# EAGLE design motors_motherBoard_simple (EAGLE 9.0.1)
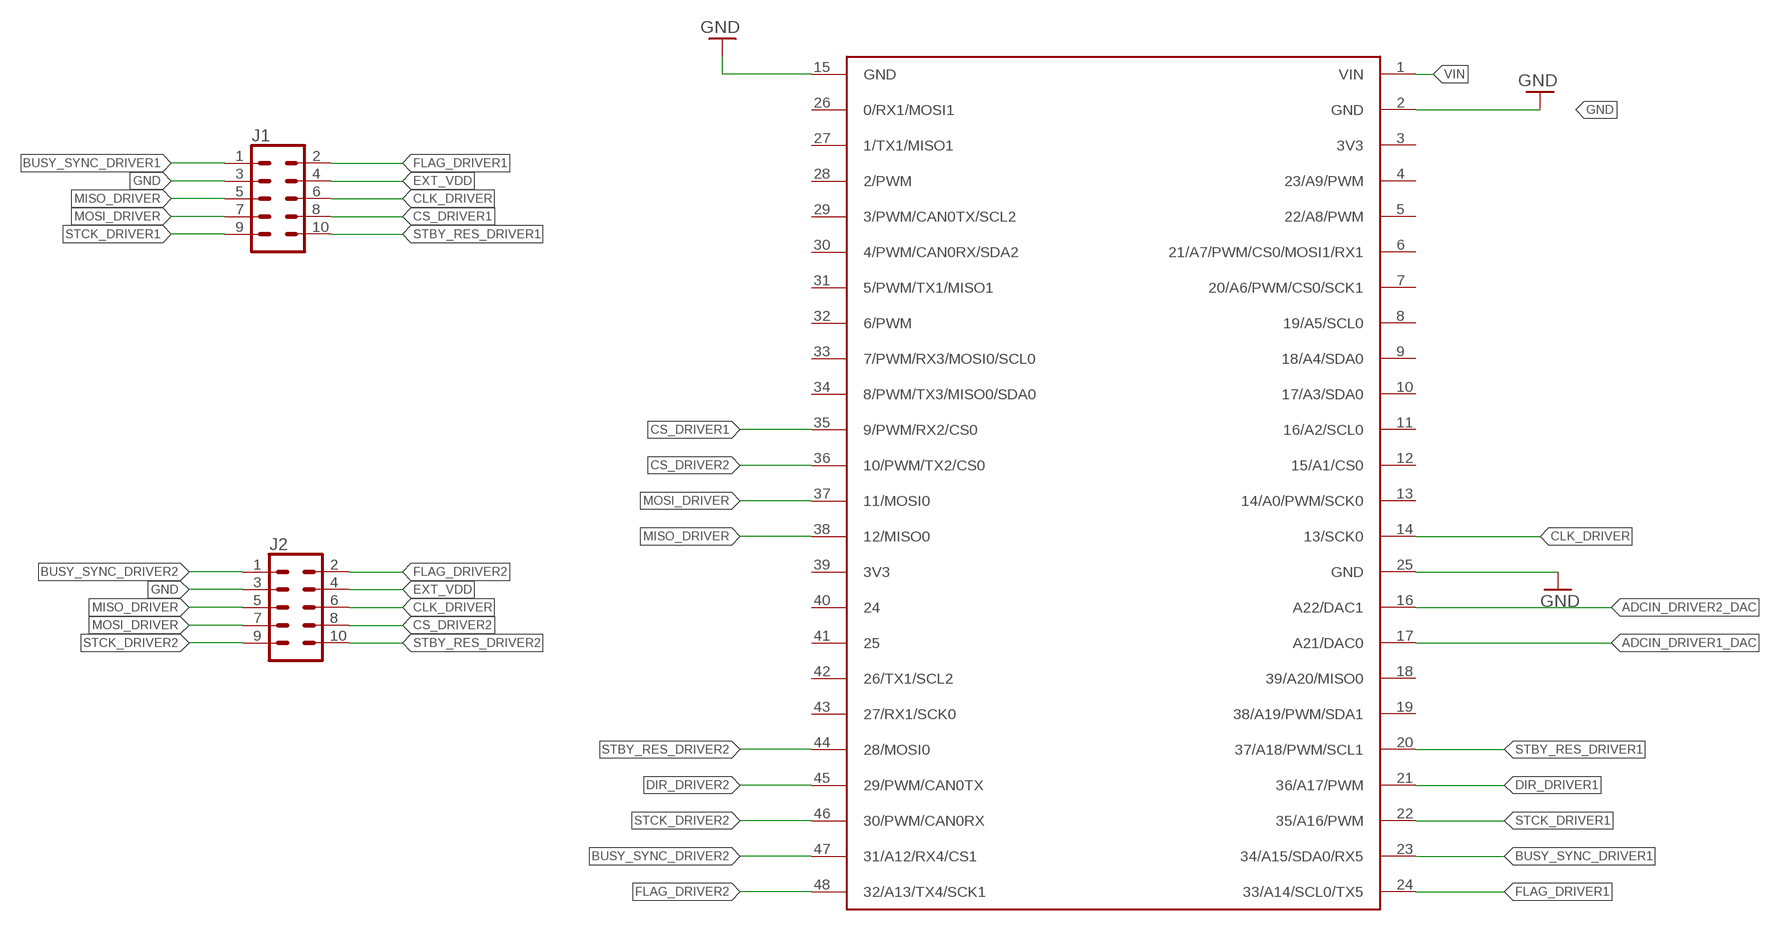
[diagram p0: schematic, sheet 1]

## Parts
J1  CONN_05X2SHD_LOCK  [2X5-SHROUDED_LOCK]
J2  CONN_05X2SHD_LOCK  [2X5-SHROUDED_LOCK]
U$3  TEENSY_BASE_ADAPTER  [TEENSY_BASE_ADAPTER]

## Nets
ADCIN_DRIVER1_DAC: U$3.17(A21/DAC0)
ADCIN_DRIVER2_DAC: U$3.16(A22/DAC1)
BUSY_SYNC_DRIVER1: J1.1 U$3.23(34/A15/SDA0/RX5)
BUSY_SYNC_DRIVER2: J2.1 U$3.47(31/A12/RX4/CS1)
CLK_DRIVER: J1.6 J2.6 U$3.14(13/SCK0)
CS_DRIVER1: J1.8 U$3.35(9/PWM/RX2/CS0)
CS_DRIVER2: J2.8 U$3.36(10/PWM/TX2/CS0)
DIR_DRIVER1: U$3.21(36/A17/PWM)
DIR_DRIVER2: U$3.45(29/PWM/CAN0TX)
EXT_VDD: J1.4 J2.4
FLAG_DRIVER1: J1.2 U$3.24(33/A14/SCL0/TX5)
FLAG_DRIVER2: J2.2 U$3.48(32/A13/TX4/SCK1)
GND: J1.3 J2.3 U$3.2(GND) U$3.15(GND) U$3.25(GND)
MISO_DRIVER: J1.5 J2.5 U$3.38(12/MISO0)
MOSI_DRIVER: J1.7 J2.7 U$3.37(11/MOSI0)
STBY_RES_DRIVER1: J1.10 U$3.20(37/A18/PWM/SCL1)
STBY_RES_DRIVER2: J2.10 U$3.44(28/MOSI0)
STCK_DRIVER1: J1.9 U$3.22(35/A16/PWM)
STCK_DRIVER2: J2.9 U$3.46(30/PWM/CAN0RX)
VIN: U$3.1(VIN)
Unconnected: U$3.3(3V3) U$3.4(23/A9/PWM) U$3.5(22/A8/PWM) U$3.6(21/A7/PWM/CS0/MOSI1/RX1) U$3.7(20/A6/PWM/CS0/SCK1) U$3.8(19/A5/SCL0) U$3.9(18/A4/SDA0) U$3.10(17/A3/SDA0) U$3.11(16/A2/SCL0) U$3.12(15/A1/CS0) U$3.13(14/A0/PWM/SCK0) U$3.18(39/A20/MISO0) U$3.19(38/A19/PWM/SDA1) U$3.26(0/RX1/MOSI1) U$3.27(1/TX1/MISO1) U$3.28(2/PWM) U$3.29(3/PWM/CAN0TX/SCL2) U$3.30(4/PWM/CAN0RX/SDA2) U$3.31(5/PWM/TX1/MISO1) U$3.32(6/PWM) U$3.33(7/PWM/RX3/MOSI0/SCL0) U$3.34(8/PWM/TX3/MISO0/SDA0) U$3.39(3V3) U$3.40 U$3.41 U$3.42(26/TX1/SCL2) U$3.43(27/RX1/SCK0)

## Library data of the parts
J1 J2 = SparkFun-Connectors:CONN_05X2: Multi connection point. Often used as Generic Header-pin footprint for 0.1 inch spaced/style header connections For AVR SPI programming port, see special device with nice symbol: "AVR_SPI_PROG_5x2.dev" You can populate with any combo of single row headers, but if you'd like an exact match, check these: 2x5 AVR ICSP Male Header <https://www.sparkfun.com/products/778> (PRT-00778) 2x5 Pin Shrouded Header <https://www.sparkfun.com/products/8506> (PRT-08506) On any of the 0.1 inch spaced packages, you can populate with these: Break Away Headers - Straight <https://www.sparkfun.com/products/116> (PRT-00116) Break Away Male Headers - Right Angle <https://www.sparkfun.com/products/553> (PRT-00553) Female Headers <https://www.sparkfun.com/products/115> (PRT-00115) Break Away Headers - Machine Pin <https://www.sparkfun.com/products/117> (PRT-00117) Break Away Female Headers - Swiss Machine Pin <https://www.sparkfun.com/products/743> (PRT-00743) Special note: the shrouded connector mates well with our 5x2 ribbon cables: 2x5 Pin IDC Ribbon Cable <https://www.sparkfun.com/products/8535> (PRT-08535); PROD_ID: CONN-08671; SF_ID: PRT-08506
U$3 = Usefull_ICs:TEENSY_BASE_ADAPTER

## Board
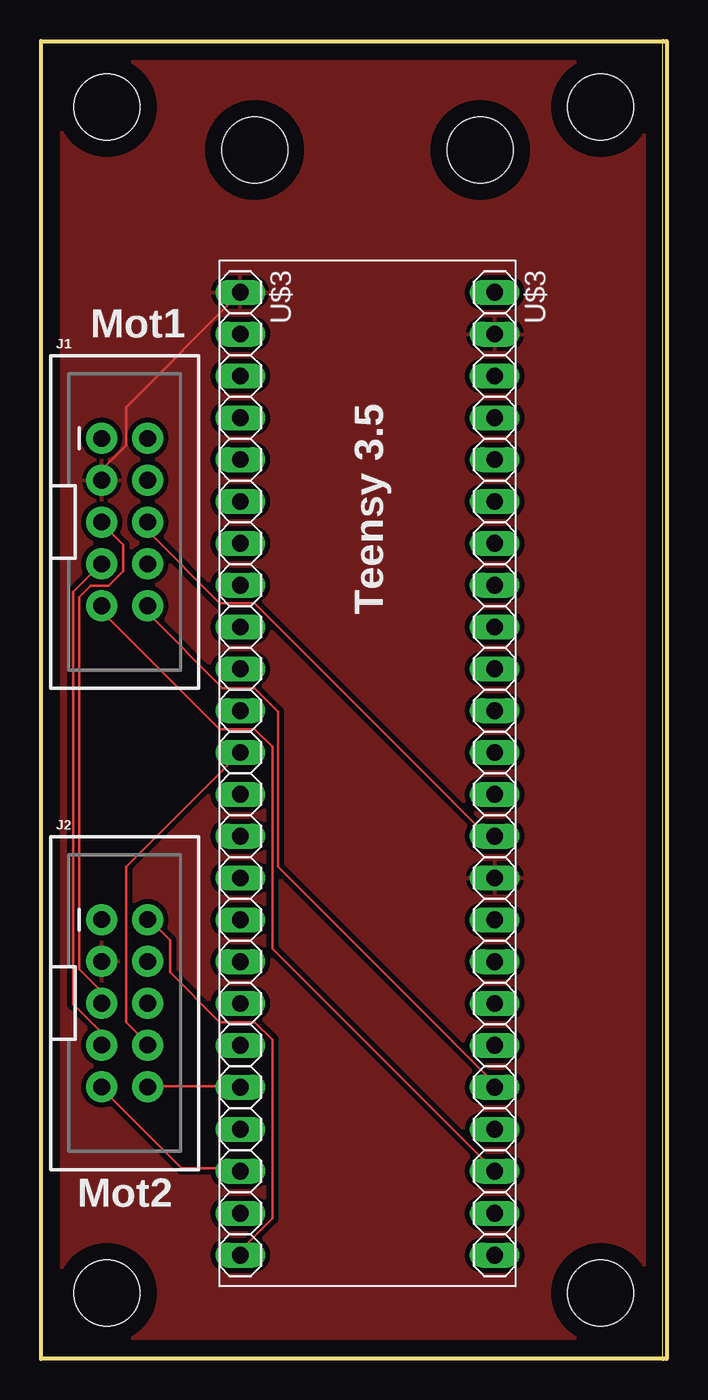
[diagram p1: board, top side]
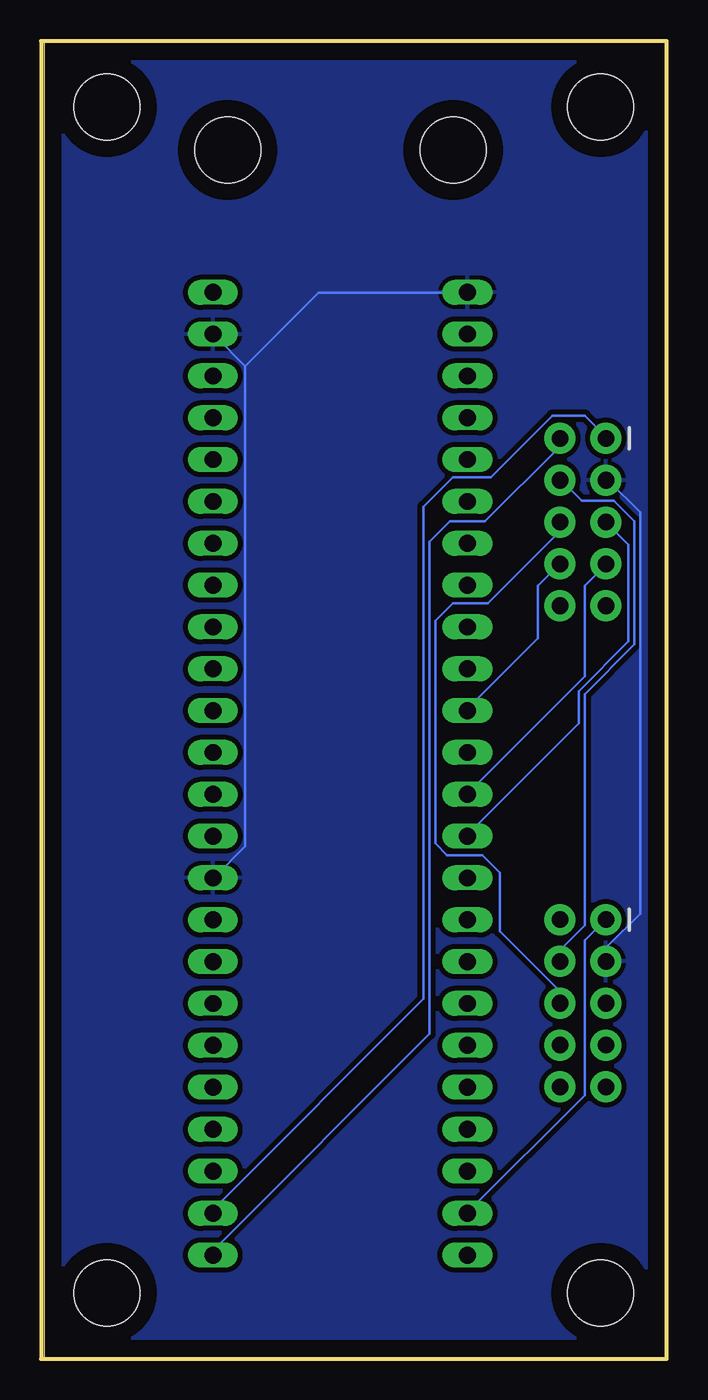
[diagram p2: board, bottom side, seen from below]

Size 38 x 80 mm. Coordinates in mm from the lower left corner, seen from the top.
Outline: 37.77,0 37.77,80
Outline: 37.77,80 0,80 0,0 37.77,0
Outline: 37.77,80 38,80 38,0 37.77,0
Copper layers (1*16): Top 0.035mm / dielectric 1.5mm / Bottom 0.035mm
Design rules "default *": minimum track width 6mil, minimum drill 0.35mm, track to track 8mil, track to pad 8mil, pad to pad 8mil, via to via 8mil, smd to smd 8mil, copper to edge 40mil, drill to drill 6mil, minimum pad ring 10mil, minimum via ring 8mil, stop-mask expansion 4mil, vias tented up to drill 0mil, thermal gap 10mil
Holes 4 mm at 12.97,73.39 26.67,73.39 4,76 34,76 4,4 34,4

### Footprints (pad centres in the part's own frame; a part is rotated, then mirrored left to right if it is on the bottom)
2X5-SHROUDED_LOCK = drill 1.016 pad 1.88: 1 -1.397,5.08; 2 1.397,5.08; 3 -1.397,2.54; 4 1.397,2.54; 5 -1.397,0; 6 1.397,0; 7 -1.397,-2.54; 8 1.397,-2.54; 9 -1.397,-5.08; 10 1.397,-5.08
TEENSY_BASE_ADAPTER = drill 1.016 long: 1 -29.21,7.73; 2 -26.67,7.73; 3 -24.13,7.73; 4 -21.59,7.73; 5 -19.05,7.73; 6 -16.51,7.73; 7 -13.97,7.73; 8 -11.43,7.73; 9 -8.89,7.73; 10 -6.35,7.73; 11 -3.81,7.73; 12 -1.27,7.73; 13 1.27,7.73; 14 3.81,7.73; 15 6.35,7.73; 16 8.89,7.73; 17 11.43,7.73; 18 13.97,7.73; 19 16.51,7.73; 20 19.05,7.73; 21 21.61,7.73; 22 24.15,7.73; 23 26.71,7.73; 24 29.25,7.73; 25 -29.21,-7.73; 26 -26.67,-7.73; 27 -24.13,-7.73; 28 -21.59,-7.73; 29 -19.05,-7.73; 30 -16.51,-7.73; 31 -13.97,-7.73; 32 -11.43,-7.73; 33 -8.89,-7.73; 34 -6.35,-7.73; 35 -3.81,-7.73; 36 -1.27,-7.73; 37 1.27,-7.73; 38 3.81,-7.73; 39 6.35,-7.73; 40 8.89,-7.73; 41 11.43,-7.73; 42 13.97,-7.73; 43 16.51,-7.73; 44 19.05,-7.73; 45 21.61,-7.73; 46 24.15,-7.73; 47 26.71,-7.73; 48 29.25,-7.73

### Placement (x,y rotation side)
J1  5.08,50.8 0 top
J2  5.08,21.59 0 top
U$3  19.83,35.54 270 top

### Tracks (layer width: path | path; a pad name or v marks a point on that pad's centre or on a via)
BUSY_SYNC_DRIVER1
  Bottom 0.152: U$3.23 27.38,8.89 27.38,9.25 14.76,21.87 14.76,51.74 12.98,53.52 10.67,53.52 6.93,57.25 4.98,57.25 3.73,56.01 J1.1
BUSY_SYNC_DRIVER2
  Bottom 0.152: U$3.47 12.09,8.89 4.98,16 4.98,25.43 3.73,26.67 J2.1
CLK_DRIVER
  Top 0.152: U$3.14 27.38,31.83 27.03,31.83 12.98,45.87 10.85,45.87 6.58,50.14 6.58,50.67 J1.6
  Bottom 0.152: J2.6 6.58,21.69 6.58,22.4 10.13,25.96 10.13,29.52 11.2,30.58 13.34,30.58 14.05,31.29 14.05,44.81 12.98,45.87 10.85,45.87 6.58,50.14 6.58,50.67 J1.6
CS_DRIVER1
  Bottom 0.152: U$3.35 12.09,39.47 7.82,43.74 7.82,46.94 6.58,48.18 J1.8
CS_DRIVER2
  Top 0.152: U$3.36 5.16,29.87 5.16,20.45 6.4,19.2 J2.8
EXT_VDD
  Bottom 0.152: J2.4 6.4,24.18 6.4,24.89 4.98,26.31 4.98,40.36 1.96,43.38 1.96,50.85 3.2,52.09 5.16,52.09 6.4,53.34 J1.4
FLAG_DRIVER1
  Bottom 0.152: U$3.24 27.38,6.4 27.38,6.76 14.4,19.74 14.4,49.61 13.16,50.85 11.02,50.85 6.58,55.3 6.58,55.83 J1.2
FLAG_DRIVER2
  Top 0.152: U$3.48 12.27,6.4 12.27,6.76 14.05,8.53 14.05,19.38 12.98,20.45 10.85,20.45 7.82,23.47 7.82,25.43 6.58,26.67 J2.2
GND
  Top 0.152: J1.3 3.73,53.34 3.73,54.05 5.16,55.47 5.16,57.78 12.09,64.72 U$3.25
  Bottom 0.152: J2.3 3.56,24.18 3.56,25.07 1.6,27.03 1.6,51.38 3.56,53.34 J1.3 | 25.6,60.27 25.6,31.11 27.38,29.34 U$3.15 | 25.6,60.27 27.38,62.05 U$3.2 | 25.6,60.27 21.16,64.72 12.27,64.72 U$3.25
  pour Bottom (isolate 0.305): 0,0 0,80 38,80 38,0
  pour Top (isolate 0.305): 0,0 0,80 38,80 38,0
MISO_DRIVER
  Top 0.152: J2.5 3.56,21.69 3.56,22.4 2.31,23.65 2.31,46.23 3.02,46.94 4.09,46.94 4.98,47.83 4.98,49.43 3.73,50.67 J1.5
  Bottom 0.152: J1.5 2.31,49.43 2.31,43.56 5.33,40.54 5.33,38.58 12.09,31.83 U$3.38
MOSI_DRIVER
  Top 0.152: J2.7 3.56,19.2 3.56,19.91 1.96,21.51 1.96,46.58 3.56,48.18 J1.7
  Bottom 0.152: U$3.37 12.09,34.31 4.98,41.43 4.98,46.94 3.73,48.18 J1.7
STBY_RES_DRIVER1
  Top 0.152: U$3.20 27.38,16.54 27.38,16.89 14.4,29.87 14.4,39.29 12.98,40.72 11.02,40.72 6.58,45.16 6.58,45.7 J1.10
STBY_RES_DRIVER2
  Top 0.152: U$3.44 12.09,16.54 6.58,16.54 J2.10
STCK_DRIVER1
  Top 0.152: U$3.22 27.38,11.56 14.05,24.89 14.05,37.16 12.98,38.23 10.85,38.23 3.73,45.34 3.73,45.7 J1.9
STCK_DRIVER2
  Top 0.152: U$3.46 12.09,11.56 8.53,11.56 3.73,16.36 J2.9

### Text on the board
tPlace: Mot1 | Teensy 3.5 | Mot2